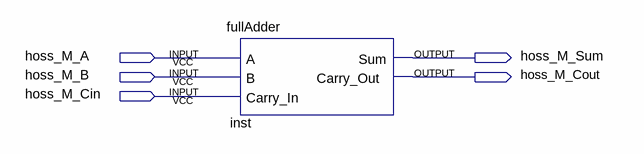
[diagram p0: schematic sheet]
// Quartus schematic fulladdersymbol.bdf as structural Verilog: 1 symbols, 5 pins
module fulladdersymbol (
  input  hoss_M_A,
  input  hoss_M_B,
  input  hoss_M_Cin,
  output hoss_M_Sum,
  output hoss_M_Cout
);

  fullAdder inst (.A(hoss_M_A), .B(hoss_M_B), .Carry_In(hoss_M_Cin), .Sum(hoss_M_Sum), .Carry_Out(hoss_M_Cout));
endmodule
